# Altium schematic sheet Connectors_and_mechanical.SchDoc: Binary to DEC/HEX/BCD/U2/U1
size A4; Author: Jakub Kajzer; DrawnBy: Jakub Kajzer; DocumentNumber: 3; Revision: 1.0; SheetNumber: 3; SheetTotal: 3
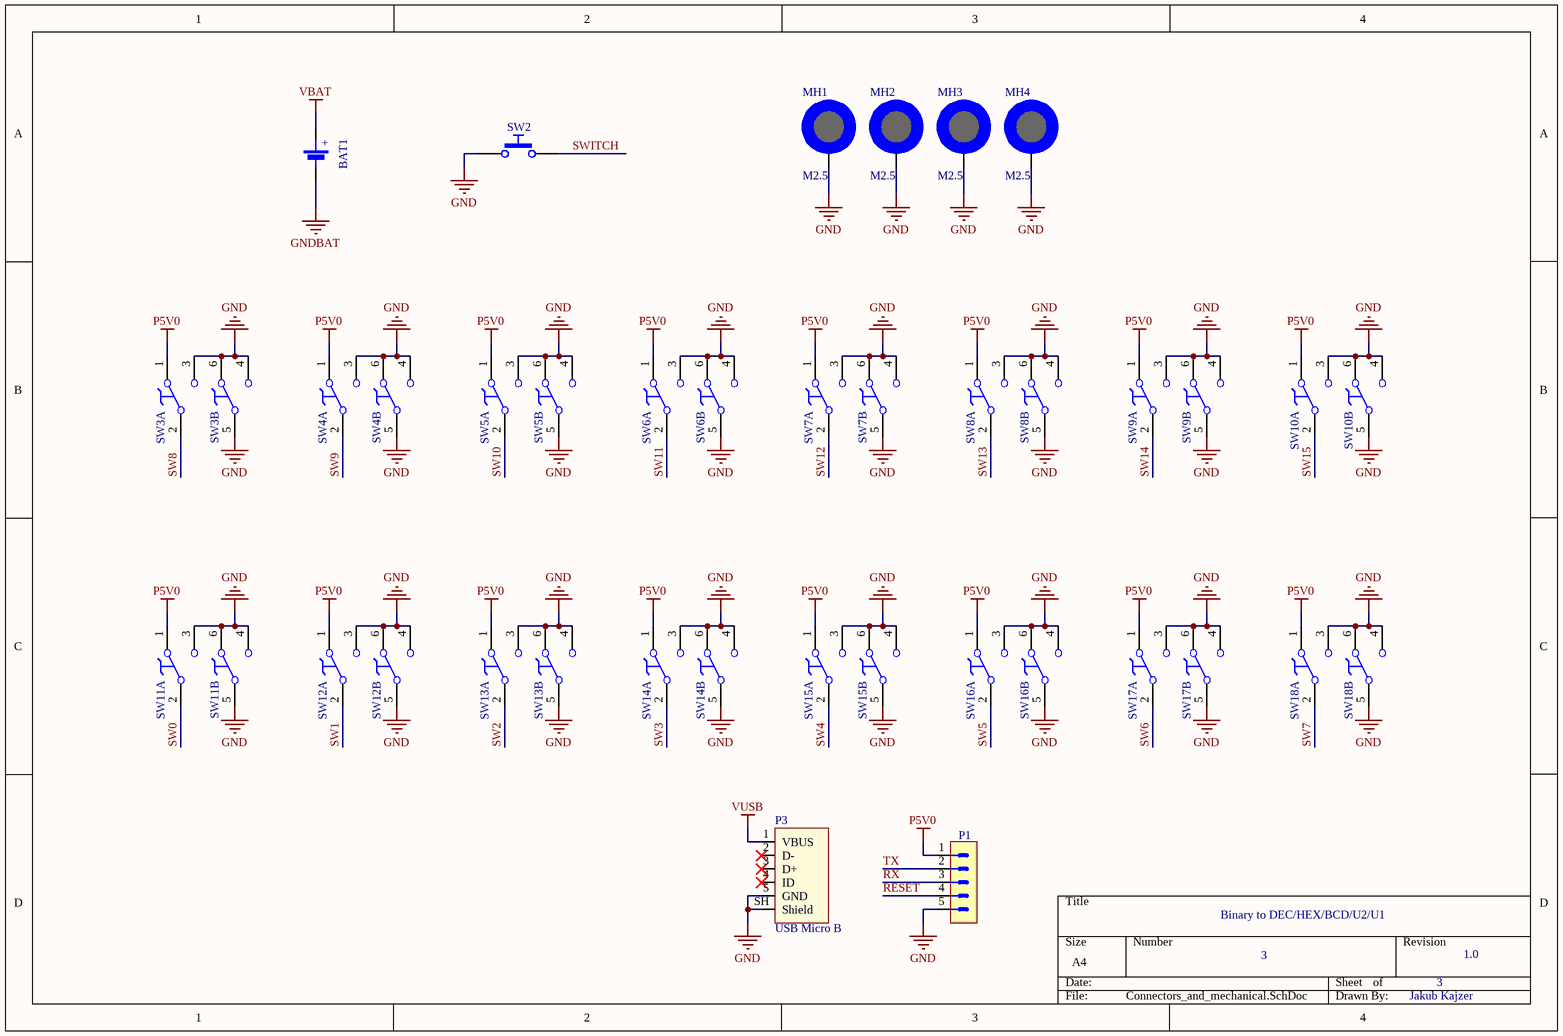
[diagram p0: Connectors_and_mechanical.SchDoc]

## Parts
BAT1  (no value)  [18650 Holder]
MH1  M2.5  [MH-M2.5_COPPER]  (no BOM)
MH2  M2.5  [MH-M2.5_COPPER]  (no BOM)
MH3  M2.5  [MH-M2.5_COPPER]  (no BOM)
MH4  M2.5  [MH-M2.5_COPPER]  (no BOM)
P1  SSW-105-02-G-S  [SAMTEC_SSW-105-02-G-S]  (value not drawn)
P3  USB Micro B  [USB Micro]
SW2  PTS636  [PTS636_SMT_G]  (value not drawn)
SW3  SS008B  [SS008B-02P-22]  (value not drawn)  (parts A,B of 2)
SW4  SS008B  [SS008B-02P-22]  (value not drawn)  (parts A,B of 2)
SW5  SS008B  [SS008B-02P-22]  (value not drawn)  (parts A,B of 2)
SW6  SS008B  [SS008B-02P-22]  (value not drawn)  (parts A,B of 2)
SW7  SS008B  [SS008B-02P-22]  (value not drawn)  (parts A,B of 2)
SW8  SS008B  [SS008B-02P-22]  (value not drawn)  (parts A,B of 2)
SW9  SS008B  [SS008B-02P-22]  (value not drawn)  (parts A,B of 2)
SW10  SS008B  [SS008B-02P-22]  (value not drawn)  (parts A,B of 2)
SW11  SS008B  [SS008B-02P-22]  (value not drawn)  (parts A,B of 2)
SW12  SS008B  [SS008B-02P-22]  (value not drawn)  (parts A,B of 2)
SW13  SS008B  [SS008B-02P-22]  (value not drawn)  (parts A,B of 2)
SW14  SS008B  [SS008B-02P-22]  (value not drawn)  (parts A,B of 2)
SW15  SS008B  [SS008B-02P-22]  (value not drawn)  (parts A,B of 2)
SW16  SS008B  [SS008B-02P-22]  (value not drawn)  (parts A,B of 2)
SW17  SS008B  [SS008B-02P-22]  (value not drawn)  (parts A,B of 2)
SW18  SS008B  [SS008B-02P-22]  (value not drawn)  (parts A,B of 2)

## Nets
GND: MH1.MH MH2.MH MH3.MH MH4.MH P1.5 P3.5(GND) P3.SH(Shield) SW2.1 SW3.3 SW3.4 SW3.5 SW3.6 SW4.3 SW4.4 SW4.5 SW4.6 SW5.3 SW5.4 SW5.5 SW5.6 SW6.3 SW6.4 SW6.5 SW6.6 SW7.3 SW7.4 SW7.5 SW7.6 SW8.3 SW8.4 SW8.5 SW8.6 SW9.3 SW9.4 SW9.5 SW9.6 SW10.3 SW10.4 SW10.5 SW10.6 SW11.3 SW11.4 SW11.5 SW11.6 SW12.3 SW12.4 SW12.5 SW12.6 SW13.3 SW13.4 SW13.5 SW13.6 SW14.3 SW14.4 SW14.5 SW14.6 SW15.3 SW15.4 SW15.5 SW15.6 SW16.3 SW16.4 SW16.5 SW16.6 SW17.3 SW17.4 SW17.5 SW17.6 SW18.3 SW18.4 SW18.5 SW18.6
GNDBAT: BAT1.1(MINUS)
P5V0: P1.1 SW3.1 SW4.1 SW5.1 SW6.1 SW7.1 SW8.1 SW9.1 SW10.1 SW11.1 SW12.1 SW13.1 SW14.1 SW15.1 SW16.1 SW17.1 SW18.1
VBAT: BAT1.2(PLUS)
VUSB: P3.1(VBUS)
RESET: P1.4
RX: P1.3
SW0: SW11.2
SW1: SW12.2
SW2: SW13.2
SW3: SW14.2
SW4: SW15.2
SW5: SW16.2
SW6: SW17.2
SW7: SW18.2
SW8: SW3.2
SW9: SW4.2
SW10: SW5.2
SW11: SW6.2
SW12: SW7.2
SW13: SW8.2
SW14: SW9.2
SW15: SW10.2
SWITCH: SW2.2
TX: P1.2

Not connected (* = marked no-connect by the designer): P3 2(D-)* 3(D+)* 4(ID)*

## Notes on the sheet
- (in symbol 18650 Holder) +

## Library data of the parts
BAT1 = 18650 Holder: 18650 Cell Battery Holder; pin to pad: 1>MINUS 2>PLUS; Manufacturer: GENERIC; Manufacturer 1 Example: COMF; Manufacturer 1 Part Number: BHC-18650-1P; Manufacturer 1 Component Height: 21mm; PressFit: No; Voltage Max: 100V; DesignItemId: 18650 Holder; Author: JK; Family: BHC; Component Kind: Standard; HelpURL: https://www.tme.eu/Document/8fa81c4c5d128169ded6af3ed3867ae3/BHC-18650-1P.pdf; Manufacturer Part Number: 18650 Holder; Mounted: Yes; Part Description: 18650 Cell Battery Holder; Pin Count: 2; Sense: No; SMD: No; Socket: Yes; Status: Recommended; Supplier 1: TME; Create Date: 20.12.2019; LatestRevisionDate: 20.12.2019; Supplier Part Number 1: BHC-18650-1P
MH1-MH4 = MH-M2.5_C: Mounting hole, M2.5, exposed pad; DesignItemId: MH-M2.5_C; Author: KB; Family: M2.5; Part Description: Mounting hole, M2.5, exposed pad; Create Date: 19.05.2011; LatestRevisionDate: 19.05.2011
P1 = HDR_THT_5X1V_F_2P54MM: General Purpose Header: THT, 2.54mm, Female, Straight, Long Lead; Manufacturer: GENERIC; Manufacturer 1 Example: Samtec; Manufacturer 1 Component Height: 11.55mm; Current Max: 3A; PressFit: No; DesignItemId: HDR_THT_5X1V_F_2P54MM; Author: UN; Family: SSW; Component Kind: Standard; Footprint: HDR_5X1V_F_2P54MM; HelpURL: https://pl.mouser.com/datasheet/2/527/ssw_th-1507658.pdf; Manufacturer Part Number: HDR_THT_5X1V_F_2P54MM; Manufacturer 1 Part Number: SSW-105-02-G-S; Mounted: Yes; Part Description: General Purpose Header: THT, 2.54mm, Female, Straight, Long Lead; Pin Count: 5; Sense: No; SMD: No; Socket: No; Status: Recommended; Supplier 1: TME; Supplier 2: Mouser; Create Date: 19.08.2014; LatestRevisionDate: 19.08.2014; Supplier Part Number 1: ZL262-5SG
P3 = 10118192-0001LF: USB B micro; SMT; PIN: 5; Horizontal; V: USB 2.0; Manufacturer 1: ADAM TECH; Manufacturer Part Number 1: MUSB-B5-S-RA-TSMT-CS1; Manufacturer: AMPHENOL; Manufacturer 1 Component Height: 2.8mm; PressFit: No; Supplier 1: TME; Supplier Part Number 1: 10118192-0001LF/C; SMD: Yes; Socket: No; Pin count: 5; DesignItemId: 10118192-0001LF; Author: JK; Family: USB Micro B; Component Kind: Standard; HelpURL: https://www.tme.eu/Document/72ced03c59c3e8fbc7670eebe358f9ff/10118192-0001LF.pdf; Manufacturer Part Number: 10118192-0001LF; Manufacturer 1 Example: AMPHENOL; Manufacturer 1 Part Number: 10118192-0001LF; Mounted: Yes; Part Description: USB B micro; SMT; PIN: 5; Horizontal; V: USB 2.0; Sense: No; Status: Recommended; Create Date: 21.12.2019; LatestRevisionDate: 21.12.2019
SW2 = SMD_TACT_6P0X3P5MM: Tactile Switches Tact 50mA 12VDC, 6.0x3.5, 4.3mm H, 180gf, G leads, No ground pin, Black Actuator; Manufacturer: C&K; Manufacturer Part Number: PTS636 SM43 SMTR LFS; Manufacturer 1 Example: S&K; PressFit: No; DesignItemId: SMD_TACT_6P0X3P5MM; Author: KB; Family: PTS636; Component Kind: Standard; HelpURL: https://pl.mouser.com/datasheet/2/60/pts636-1550567.pdf; Manufacturer 1 Part Number: PTS636 SM43 SMTR LFS; Manufacturer 1 Component Height: 4.3mm; Mounted: Yes; Part Description: Tactile Switches Tact 50mA 12VDC, 6.0x3.5, 4.3mm H, 180gf, G leads, No ground pin, Black Actuator; Pin Count: 2; Sense: No; SMD: Yes; Socket: No; Status: Recommended; Supplier 1: Mouser; Supplier 2: Digi-Key; Create Date: 30.07.2019; LatestRevisionDate: 30.07.2019; Supplier Part Number 1: 611-PTS636SM43SMTRLF
SW3-SW18 = SS008B-02P-22: Switch  2 position; DPDT; 0,3A/30VDC; ON-ON; 50mŁ[; Manufacturer: CANAL ELECTRONIC; Manufacturer 1 Component Height: 4.7mm; PressFit: No; DesignItemId: SS008B-02P-22; Author: JK; Family: SS008B; Component Kind: Standard; HelpURL: https://www.tme.eu/Document/b70a8664e2e58da8ce3209f25de299f1/ss008b02p22.pdf; Manufacturer Part Number: SS008B-02P-22; Manufacturer 1 Example: CANAL ELECTRONIC; Manufacturer 1 Part Number: SS008B-02P-22; Mounted: Yes; Part Description: Switch  2 position; DPDT; 0,3A/30VDC; ON-ON; 50mŁ[; Pin Count: 6; Sense: No; SMD: No; Socket: No; Status: Recommended; Supplier 1: TME; Create Date: 04.12.2019; LatestRevisionDate: 04.12.2019; Supplier Part Number 1: SS008B02P22